# Altium schematic sheet PowerSection_V2.SchDoc: Power Section
size 420 x 297 mm; SheetNumber: 3; SheetTotal: 3
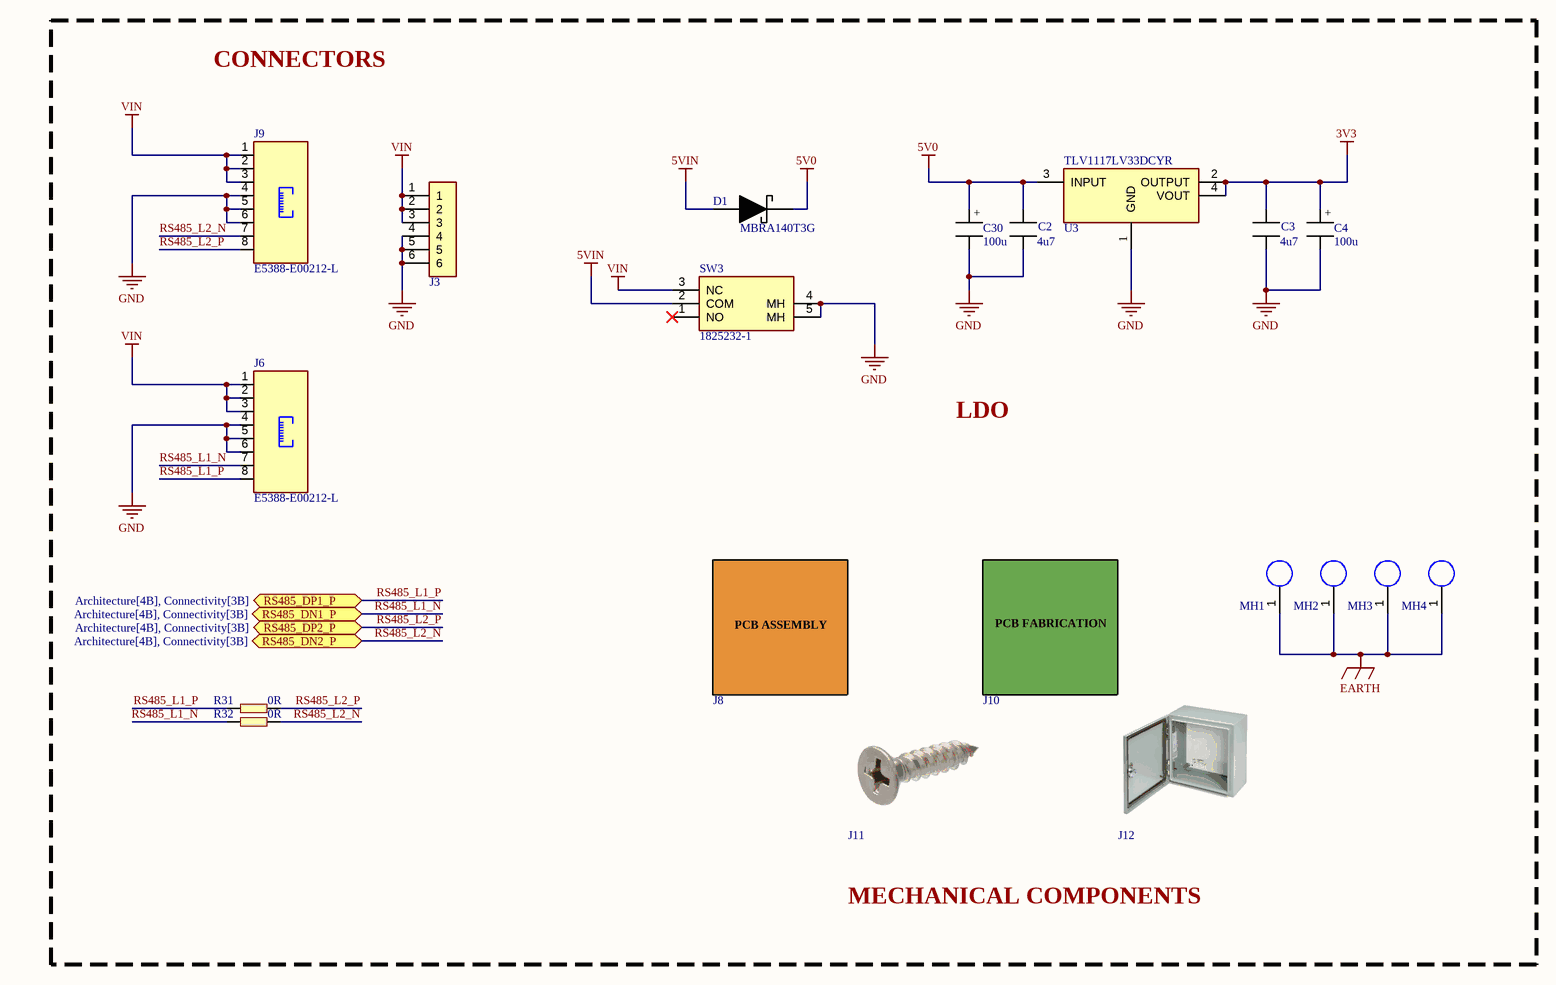
[diagram p0: PowerSection_V2.SchDoc]

## Parts
C2  value 4u7  [CAPC1608X10N]  (hidden comment: ERP_102-1)
C3  value 4u7  [CAPC1608X10N]  (hidden comment: ERP_102-1)
C4  value 100u  [CAP_6.3_7.7]  (hidden comment: ERP_102-2)
C30  value 100u  [CAP_6.3_7.7]  (hidden comment: ERP_102-2)
D1  value MBRA140T3G  [SS14_SMA]  (hidden comment: ERP_104-3)
J3  6Pin_TerminalBlock_5.08P  [6Pin_TerminalBlock_5.08P]  (value not drawn)
J6  value E5388-E00212-L  [RJ45]  (hidden comment: ERP_148-3)
J8  APCB  (value not drawn)
J9  value E5388-E00212-L  [RJ45]  (hidden comment: ERP_148-3)
J10  BPCB  (value not drawn)
J11  SCREW  (value not drawn)
J12  ENCLOSURE  (value not drawn)
MH1  MountingHole4X6  [MountingHole4X6]  (value not drawn)  (graphical)
MH2  MountingHole4X6  [MountingHole4X6]  (value not drawn)  (graphical)
MH3  MountingHole4X6  [MountingHole4X6]  (value not drawn)  (graphical)
MH4  MountingHole4X6  [MountingHole4X6]  (value not drawn)  (graphical)
R31  value 0R  [RES_0603]  (hidden comment: ERP_101-1)
R32  value 0R  [RES_0603]  (hidden comment: ERP_101-1)
SW3  value 1825232-1  [3PIN_SPDT_TH_RA]  (hidden comment: ERP_110-4)
U3  value TLV1117LV33DCYR  [AMS1117_SOT223]  (hidden comment: ERP_123-1)

## Ports
RS485_DN1_P (bidir, see Architecture[4B], Connectivity[3B]), RS485_DN2_P (bidir, see Architecture[4B], Connectivity[3B]), RS485_DP1_P (bidir, see Architecture[4B], Connectivity[3B]), RS485_DP2_P (bidir, see Architecture[4B], Connectivity[3B])

## Nets
3V3: C3.1 C4.1 U3.2(OUTPUT) U3.4(VOUT)
5V0: C2.1 C30.1 D1.1(C) U3.3(INPUT)
5VIN: D1.2(A) SW3.2(COM)
EARTH: MH1.1 MH2.1 MH3.1 MH4.1
GND: C2.2 C3.2 C4.2 C30.2 J3.4 J3.5 J3.6 J6.4 J6.5 J6.6 J9.4 J9.5 J9.6 SW3.4(MH) SW3.5(MH) U3.1(GND)
VIN: J3.1 J3.2 J3.3 J6.1 J6.2 J6.3 J9.1 J9.2 J9.3 SW3.3(NC)
RS485_L1_N: J6.7 R32.2 ; port RS485_DN1_P
RS485_L1_P: J6.8 R31.2 ; port RS485_DP1_P
RS485_L2_N: J9.7 R32.1 ; port RS485_DN2_P
RS485_L2_P: J9.8 R31.1 ; port RS485_DP2_P

Not connected (* = marked no-connect by the designer): SW3 1(NO)*

## Notes on the sheet
- CONNECTORS
- LDO
- MECHANICAL COMPONENTS
- PROJECT
- SIZE
- FILE NAME
- A3
- TITLE
- SHEET
- OF
- REV
- (in symbol APCB) PCB ASSEMBLY
- (in symbol BPCB) PCB FABRICATION
- (in symbol CAP_6.3_7.7) +

## Library data of the parts
C2 C3 = MLCC_0603: MLCC 0603; Manufacturer 1: Murata; Manufacturer Part Number 1: GRM188R6YA475KE15D; Package: 0603; Suuplier Part Number 1: *; ERP: *; Supplier 1: Digikey; Supplier Part Number 1: 490-7205-1-ND
C4 C30 = CAP_6.3_7.7: Electrolytic Capacitor SMD 6.3x7.7; Manufacturer 1: Nichicon; Manufacturer Part Number 1: UWT1V101MCL1GS; Suuplier Part Number 1: 493-2203-1-ND; Package: 6.3x7.7; ERP: *; Supplier 1: Digikey; Supplier Part Number 1: 493-2203-1-ND
D1 = SS14_SMA: Manufacturer 1: ONSEMi; Supplier Part Number 1: *; Supplier  1: *; Package: SMA; Manufacturer Part Number 1: MBRA140T3G; ERP: *; Supplier 1: Digikey; Supplier Part Number 1: MBRA140T3GOSCT-ND
J3 = 6Pin_TerminalBlock_5.08P: 6PINS TERMINAL BLOCK 5.08 PITCH; Manufacturer Part Number 1: Generic; Value: 6 Pin Screw Terminal; Manufacturer 1: Generic; Supplier Part Number 1: Robu; Supplier 1: 528512; ERP: *; Package: 6PIN
J6 J9 = RJ45: CONN MOD JACK 8P8C R/A UNSHLD; Manufacturer 1: Pulse Electronics; Manufacturer Part Number 1: E5388-E00212-L; ERP: *; Package: 8P8C; Supplier 1: *; Supplier Part Number 1: *; Supplier 2: Digikey; Supplier Part Number 2: 553-E5388-E00212-L-ND
J8 = APCB: Assembled PCB; Value: *; Manufacturer 1: *; Manufacturer Part Number 1: *
J10 = BPCB: Bare PCB; Manufacturer Part Number 1: *; Manufacturer 1: *; Value: *
J11 = SCREW: Mounting Screw
J12 = ENCLOSURE: PCB Enclosure; Manufacturer Part Number 1: *; Manufacturer 1: *; Value: *
R31 R32 = RES_0603: Manufacturer 1: Yageo; Manufacturer Part Number 1: RC0603JR-070RL; Package: 0603; Suuplier Part Number 1: *; ERP: *; Supplier 1: Digikey; Supplier Part Number 1: 311-0.0GRCT-ND
SW3 = 3PIN_SPDT_TH_RA: Manufacturer 1: TE; ERP: *; Manufacturer Part Number 1: 1825232-1; Package: 6X6; Supplier 1: *; Supplier Part Number 1: *; Supplier 2: Digikey; Supplier Part Number 2: A107673-ND
U3 = AMS1117_SOT223: AMS1117 LDO; Manufacturer 1: TI; Supplier  Part Number 1: *; Supplier  1: *; Package: SOT223; Manufacturer Part Number 1: TLV1117LV33DCYR; ERP: *; Supplier 1: Digikey; Supplier Part Number 1: 296-28778-1-ND